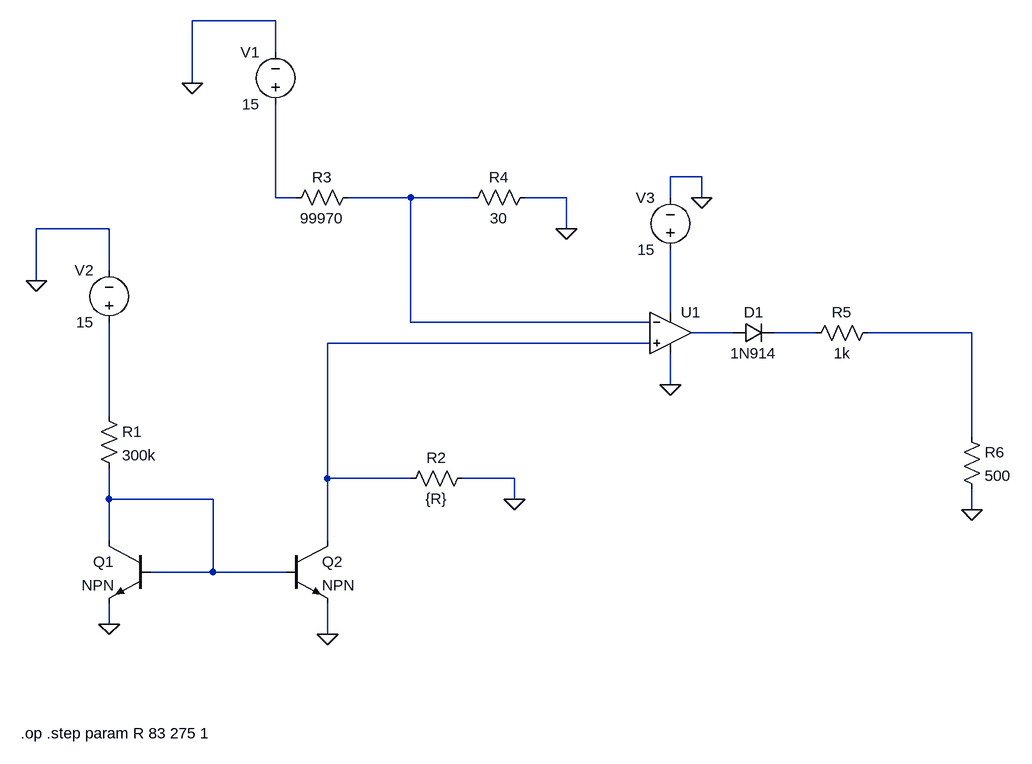
[diagram p0: schematic Problem1.asc]
Problem1.asc, the LTspice schematic file:
Version 4
SHEET 1 1444 680
WIRE 304 -1216 176 -1216
WIRE 304 -1168 304 -1216
WIRE 176 -1120 176 -1216
WIRE 960 -976 912 -976
WIRE 304 -944 304 -1088
WIRE 336 -944 304 -944
WIRE 512 -944 416 -944
WIRE 608 -944 512 -944
WIRE 752 -944 688 -944
WIRE 912 -944 912 -976
WIRE 960 -944 960 -976
WIRE 48 -896 -64 -896
WIRE 752 -896 752 -944
WIRE 48 -832 48 -896
WIRE -64 -816 -64 -896
WIRE 912 -768 912 -864
WIRE 512 -752 512 -944
WIRE 880 -752 512 -752
WIRE 1008 -736 944 -736
WIRE 1136 -736 1072 -736
WIRE 1376 -736 1216 -736
WIRE 880 -720 384 -720
WIRE 912 -656 912 -704
WIRE 48 -608 48 -752
WIRE 1376 -576 1376 -736
WIRE 384 -512 384 -720
WIRE 512 -512 384 -512
WIRE 672 -512 592 -512
WIRE 48 -480 48 -528
WIRE 208 -480 48 -480
WIRE 672 -480 672 -512
WIRE 1376 -464 1376 -496
WIRE 48 -416 48 -480
WIRE 384 -416 384 -512
WIRE 208 -368 208 -480
WIRE 208 -368 112 -368
WIRE 320 -368 208 -368
WIRE 48 -288 48 -320
WIRE 384 -272 384 -320
FLAG 48 -288 0
FLAG 384 -272 0
FLAG 752 -896 0
FLAG 176 -1120 0
FLAG -64 -816 0
FLAG 1376 -464 0
FLAG 912 -656 0
FLAG 960 -944 0
FLAG 672 -480 0
SYMBOL npn 112 -416 M0
SYMATTR InstName Q1
SYMBOL npn 320 -416 R0
SYMATTR InstName Q2
SYMBOL res 32 -624 R0
SYMATTR InstName R1
SYMATTR Value 300k
SYMBOL res 608 -528 R90
WINDOW 0 0 56 VBottom 2
WINDOW 3 32 56 VTop 2
SYMATTR InstName R2
SYMATTR Value {R}
SYMBOL res 432 -960 R90
WINDOW 0 0 56 VBottom 2
WINDOW 3 32 56 VTop 2
SYMATTR InstName R3
SYMATTR Value 99970
SYMBOL res 704 -960 R90
WINDOW 0 0 56 VBottom 2
WINDOW 3 32 56 VTop 2
SYMATTR InstName R4
SYMATTR Value 30
SYMBOL res 1232 -752 R90
WINDOW 0 0 56 VBottom 2
WINDOW 3 32 56 VTop 2
SYMATTR InstName R5
SYMATTR Value 1k
SYMBOL res 1360 -592 R0
SYMATTR InstName R6
SYMATTR Value 500
SYMBOL voltage 304 -1072 R180
WINDOW 0 24 96 Left 2
WINDOW 3 24 16 Left 2
SYMATTR InstName V1
SYMATTR Value 15
SYMBOL voltage 48 -736 R180
WINDOW 0 24 96 Left 2
WINDOW 3 24 16 Left 2
SYMATTR InstName V2
SYMATTR Value 15
SYMBOL voltage 912 -848 R180
WINDOW 0 24 96 Left 2
WINDOW 3 24 16 Left 2
SYMATTR InstName V3
SYMATTR Value 15
SYMBOL diode 1008 -720 R270
WINDOW 0 32 32 VTop 2
WINDOW 3 0 32 VBottom 2
SYMATTR InstName D1
SYMATTR Value 1N914
SYMBOL OpAmps\\UniversalOpamp2 912 -736 R0
SYMATTR InstName U1
TEXT -48 -120 Left 2 !.step param R 83 275 1
TEXT -88 -120 Left 2 !.op

The netlist it stands for:
* Problem1.asc
Q1 N009 N009 0 0 NPN
Q2 N007 N009 0 0 NPN
R1 N008 N009 300k
R2 0 N007 {R}
R3 N002 N001 99970
R4 0 N002 30
R5 N006 N005 1k
R6 N006 0 500
V1 N001 0 15
V2 N008 0 15
V3 N003 0 15
D1 N004 N005 1N914
XU1 N007 N002 N003 0 N004 level.2 Avol=1Meg GBW=10Meg Slew=10Meg ilimit=25m rail=0 Vos=0 phimargin=45 en=0 enk=0 in=0 ink=0 Rin=500Meg  ; pins IN+ IN- V+ V- OUT
.model D D
.lib standard.dio
.model NPN NPN
.model PNP PNP
.lib standard.bjt
.step param R 83 275 1
.op
.lib UniversalOpamps2.sub
.backanno
.end